# Altium schematic sheet Sheet2.SchDoc
size A4; SheetNumber: 2; SheetTotal: 3
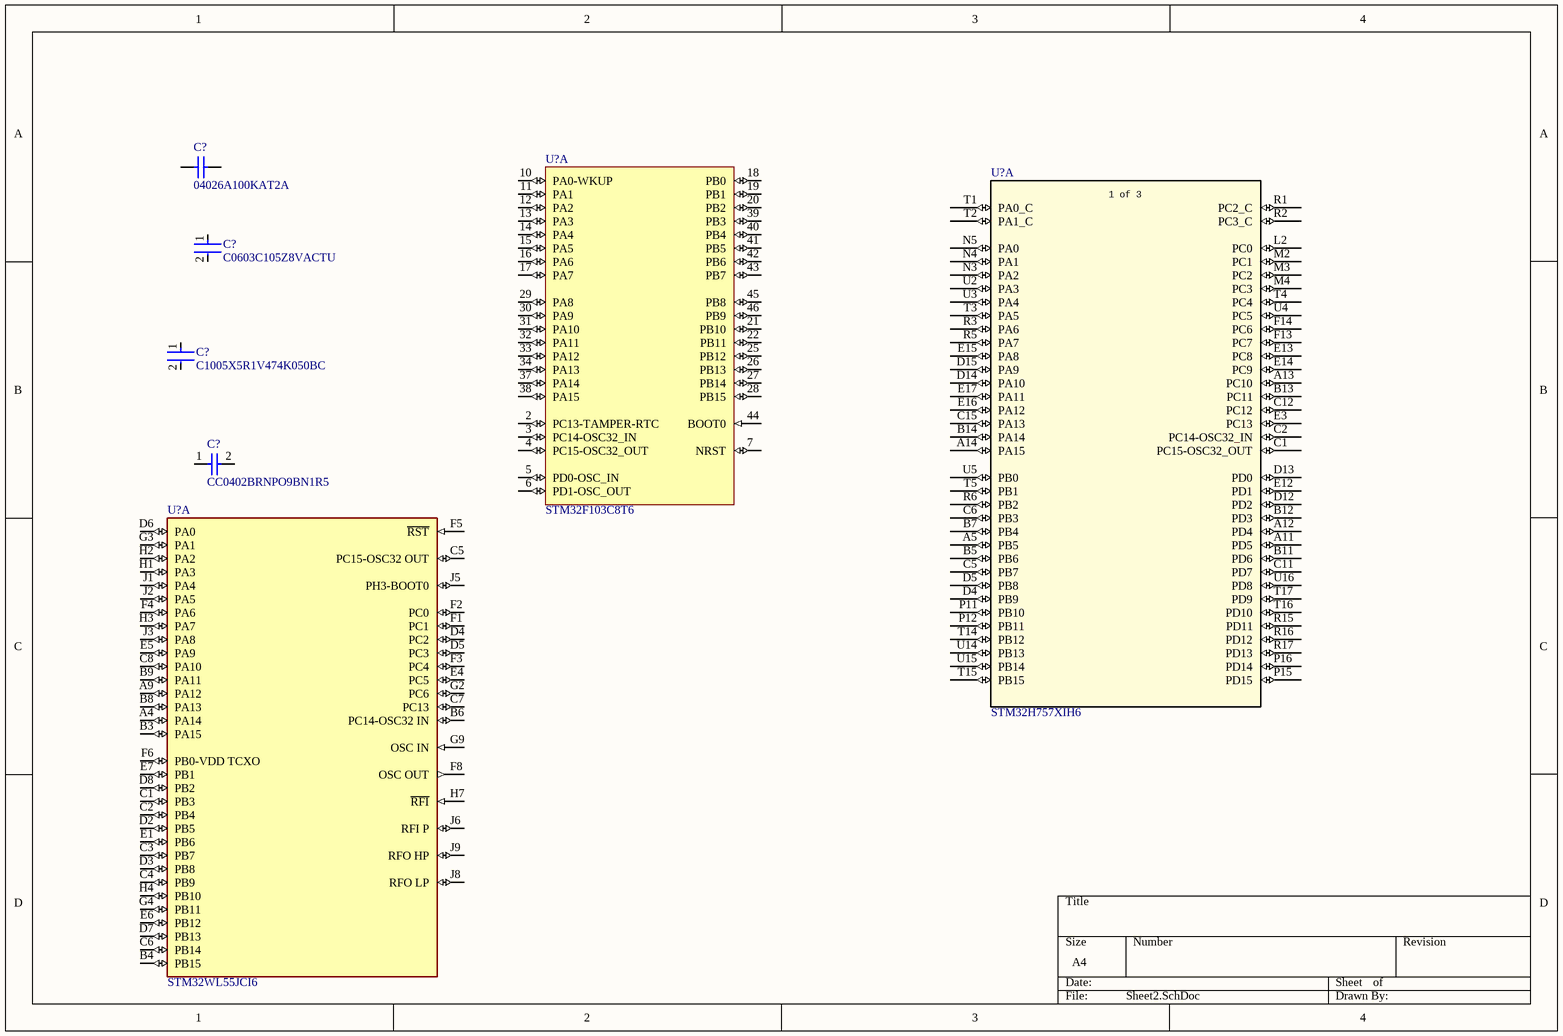
[diagram p0: Sheet2.SchDoc]

## Parts
(Parts that share a designator on the sheet are numbered #1, #2 ... from top to bottom, then left to right.)
C?#1  04026A100KAT2A  [CAPC1005X56X25LL10T15]
C?#2  C0603C105Z8VACTU  [FP-C0603-CG-IPC_A]
C?#3  C1005X5R1V474K050BC  [FP-C1005-050-0_05-IPC_A]
C?#4  CC0402BRNPO9BN1R5  [CC0402BRNPO9BN1R5-Footprint-1]
U?#1  STM32F103C8T6  [STM-LQFP48_M]  (part A of 2)
U?#2  STM32H757XIH6  [TFBGA240+25]  (part A of 4)
U?#3  STM32WL55JCI6  [FP-B08E_UFBGA73_ME-MFG]  (part A of 2)

## Nets

Not connected (* = marked no-connect by the designer): C?#1 1 2; C?#2 1 2; C?#3 1 2; C?#4 1 2; U?#1 2(PC13-TAMPER-RTC) 3(PC14-OSC32_IN) 4(PC15-OSC32_OUT) 5(PD0-OSC_IN) 6(PD1-OSC_OUT) 7(NRST) 10(PA0-WKUP) 11(PA1) 12(PA2) 13(PA3) 14(PA4) 15(PA5) 16(PA6) 17(PA7) 18(PB0) 19(PB1) 20(PB2) 21(PB10) 22(PB11) 25(PB12) 26(PB13) 27(PB14) 28(PB15) 29(PA8) 30(PA9) 31(PA10) 32(PA11) 33(PA12) 34(PA13) 37(PA14) 38(PA15) 39(PB3) 40(PB4) 41(PB5) 42(PB6) 43(PB7) 44(BOOT0) 45(PB8) 46(PB9); U?#2 A5(PB5) A11(PD5) A12(PD4) A13(PC10) A14(PA15) B5(PB6) B7(PB4) B11(PD6) B12(PD3) B13(PC11) B14(PA14) C1(PC15-OSC32_OUT) C2(PC14-OSC32_IN) C5(PB7) C6(PB3) C11(PD7) C12(PC12) C15(PA13) D4(PB9) D5(PB8) D12(PD2) D13(PD0) D14(PA10) D15(PA9) E3(PC13) E12(PD1) E13(PC8) E14(PC9) E15(PA8) E16(PA12) E17(PA11) F13(PC7) F14(PC6) L2(PC0) M2(PC1) M3(PC2) M4(PC3) N3(PA2) N4(PA1) N5(PA0) P11(PB10) P12(PB11) P15(PD15) P16(PD14) R1(PC2_C) R2(PC3_C) R3(PA6) R5(PA7) R6(PB2) R15(PD11) R16(PD12) R17(PD13) T1(PA0_C) T2(PA1_C) T3(PA5) T4(PC4) T5(PB1) T14(PB12) T15(PB15) T16(PD10) T17(PD9) U2(PA3) U3(PA4) U4(PC5) U5(PB0) U14(PB13) U15(PB14) U16(PD8); U?#3 A4(PA14) A9(PA12) B3(PA15) B4(PB15) B6(PC14-OSC32_IN) B8(PA13) B9(PA11) C1(PB3) C2(PB4) C3(PB7) C4(PB9) C5(PC15-OSC32_OUT) C6(PB14) C7(PC13) C8(PA10) D2(PB5) D3(PB8) D4(PC2) D5(PC3) D6(PA0) D7(PB13) D8(PB2) E1(PB6) E4(PC5) E5(PA9) E6(PB12) E7(PB1) F1(PC1) F2(PC0) F3(PC4) F4(PA6) F5(~{RST}) F6(PB0-VDD_TCXO) F8(OSC_OUT) G2(PC6) G3(PA1) G4(PB11) G9(OSC_IN) H1(PA3) H2(PA2) H3(PA7) H4(PB10) H7(~{RFI}) J1(PA4) J2(PA5) J3(PA8) J5(PH3-BOOT0) J6(RFI_P) J8(RFO_LP) J9(RFO_HP)

## Notes on the sheet
- (in symbol CMP-031-00008-3, part A) 1 of 3

## Library data of the parts
C?#1 = CMP-003-00182-1: Ceramic Capacitor, Multilayer, Ceramic, 6.3V, 10% +Tol, 10% -Tol, C0G, -/+30ppm/Cel TC, 0.00001uF, Surface Mount, 0402; Min Operating Temperature: -55°C; Termination: Wraparound; Packaging: Tape and Reel; Case/Package: 0402; Max Operating Temperature: 125°C; LCSC Part #: C2176086; Pins: 2
C?#2 = CMP-003-00432-1: Multilayer Ceramic Capacitor, 1 uF, 10 V, -20%, +80%, Y5V, 0603 [1608 Metric]; Tolerance: 80%; Width: 800µm; Height: 800µm; Max Operating Temperature: 85°C; Packaging: Cut Tape; Termination: SMD/SMT; Depth: 800µm; Length: 1.6mm; Min Operating Temperature: -30°C; Lead Free: Lead Free; LCSC part #: C2180996; Case/Package: 0603
C?#3 = CMP-003-00238-1: C 0402 (1005Metric) Ceramic Capacitor 0.039Lx0.020W 1.00mmx0.50mm X5R ±10% 0.47muF; Tolerance: 10%; Length: 1mm; Packaging: Cut Tape (CT); Max Operating Temperature: 85°C; Case/Package: 0402; Termination: SMD/SMT; LCSC Part £: C3852634; Height: 500µm; Width: 500µm; Lead Free: Lead Free; Min Operating Temperature: -55°C
C?#4 = CMP-003-00316-1: Surface Mount Ceramic Multilayer Capacitor 1.5pF 0.1pF C0G 50V 0402 Paper T/R; Case/Package: 0402; Max Operating Temperature: 125°C; Width: 500µm; Height: 500µm; LCSC Part #: C282238; Min Operating Temperature: -55°C; Depth: 500µm; Termination: SMD/SMT; Pins: 2; Lead Free: Lead Free; Length: 1mm; Packaging: Tape and Reel
U?#1 = CMP-003-00158-1: RISC Microcontroller, 32-Bit, FLASH, STM32 CPU, 72MHz, CMOS, PQFP48; Min Operating Temperature: -40°C; LCSC Part #: C8734; Pins: 48; Length: 7mm; Case/Package: LFQFP; Width: 7mm; Max Operating Temperature: 105°C
U?#2 = CMP-031-00008-3: High-performance and DSP with DP-FPU, Arm Cortex-M7 + Cortex-M4 MCU with 2MBytes of Flash memory, 1MB RAM, 480 MHz CPU, Art Accelerator, L1 cache, external memory interface, large set of peripherals including a Crypto accelerator, SMPS; Manufacturer_Name: STMicroelectronics; LCSC Part #: C1343741; Copyright: Copyright (C) 2025 Ultra Librarian. All rights reserved.; Component Type: Standard; Source: STM32H757XIH6.SchLib; Manufacturer_Part_Number: STM32H757XIH6; RefDes: RefDes; Design Item ID: STM32H757XIH6; Type: Type; Pins: 265
U?#3 = CMP-003-00217-5: STM32WL Series 256 kB Flash 64 kB RAM 960 MHz 32-Bit Microcontroller - UFBGA-73. POVECAN PRECNIK PADOVA ZBOG JLCPCB PRAVILA; Component Type: BGA; Min Operating Temperature: -40°C; Height: 600µm; LCSC Part #: C2969982; Max Operating Temperature: 85°C